# Altium schematic sheet [06] INERTIAL SENSOR.SchDoc: Template
size A4; Author: Hom; CompanyName: KitSprout; DrawnBy: Hom; Engineer: Hom; Organization: KitSprout; Revision: A; SheetNumber: 6; SheetTotal: 7; Version: 0.0; LibVersion: 0.0
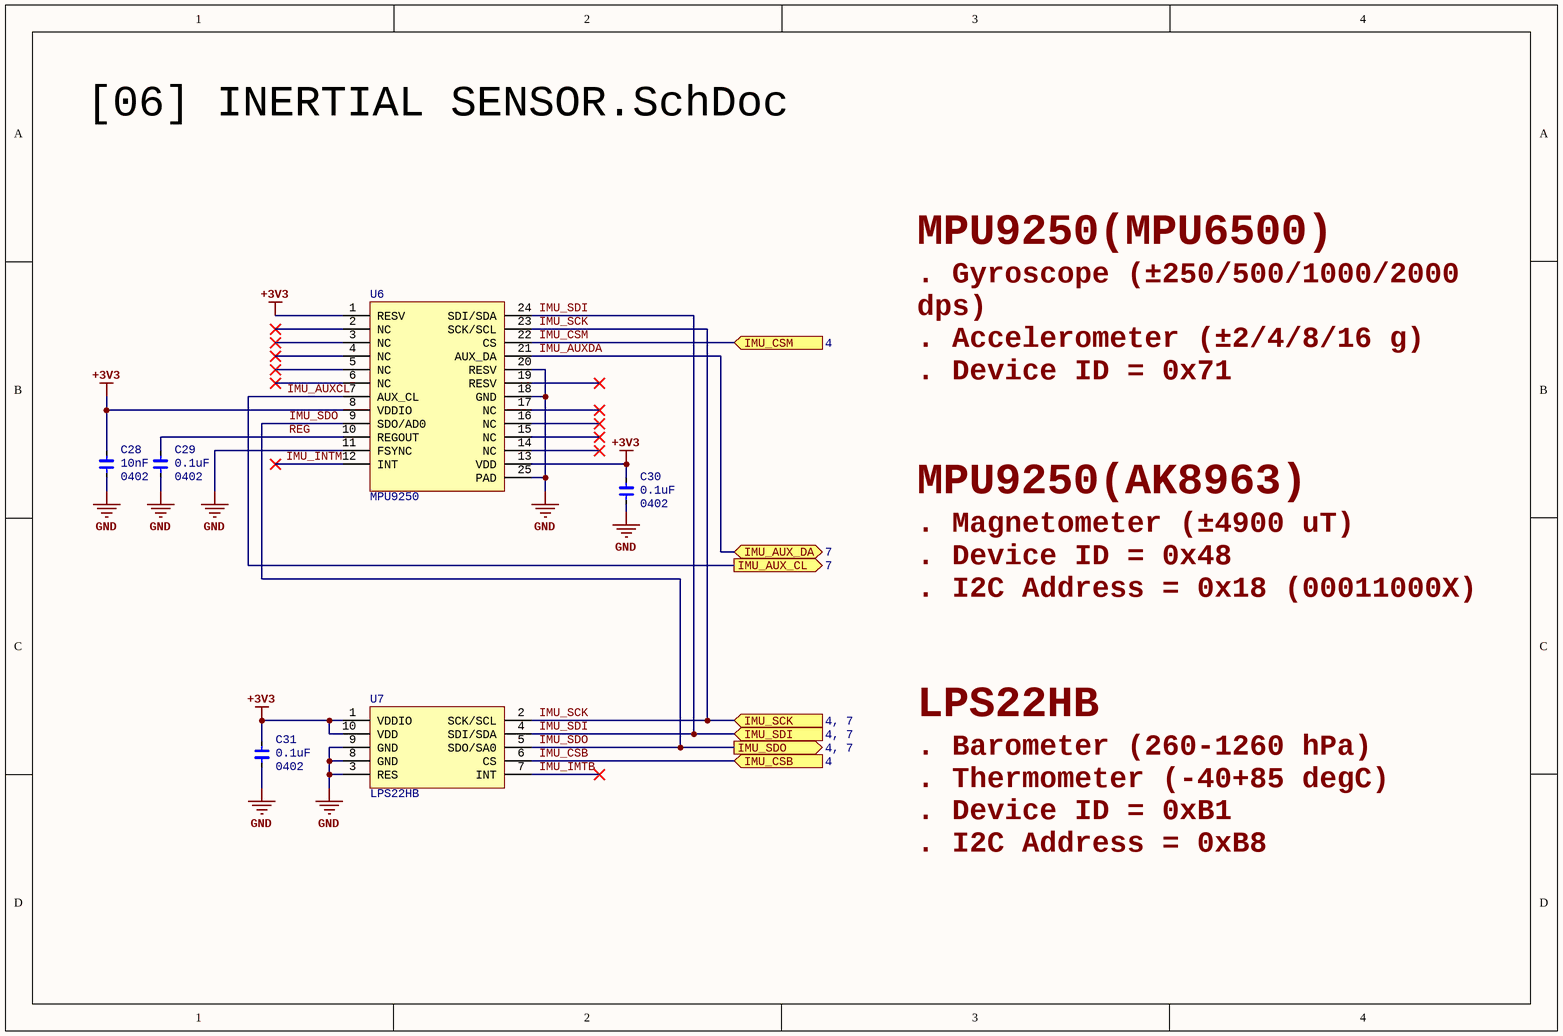
[diagram p0: [06] INERTIAL SENSOR.SchDoc]

## Parts
C28  value 10nF  Type: 0402  [CAP_0402]  (hidden comment: C0402)
C29  value 0.1uF  Type: 0402  [CAP_0402]  (hidden comment: C0402)
C30  value 0.1uF  Type: 0402  [CAP_0402]  (hidden comment: C0402)
C31  value 0.1uF  Type: 0402  [CAP_0402]  (hidden comment: C0402)
U6  MPU9250  [QFN_P0.4_24]
U7  LPS22HB  [HCLGA-2x2_10]

## Ports
IMU_AUX_CL (out, see 7), IMU_AUX_DA (bidir, see 7), IMU_CSB (in, see 4), IMU_CSM (in, see 4), IMU_SCK (in, see 4, 7), IMU_SDI (in, see 4, 7), IMU_SDO (out, see 4, 7)

## Nets
+3V3: C28.2 C30.2 C31.2 U6.1(RESV) U6.8(VDDIO) U6.13(VDD) U7.1(VDDIO) U7.10(VDD)
GND: C28.1 C29.1 C30.1 C31.1 U6.11(FSYNC) U6.18(GND) U6.20(RESV) U6.25(PAD) U7.3(RES) U7.8(GND) U7.9(GND)
IMU_AUXCL: U6.7(AUX_CL) ; port IMU_AUX_CL
IMU_AUXDA: U6.21(AUX_DA) ; port IMU_AUX_DA
IMU_CSB: U7.6(CS) ; port IMU_CSB
IMU_CSM: U6.22(CS) ; port IMU_CSM
IMU_IMTB: U7.7(INT)
IMU_INTM: U6.12(INT)
IMU_SCK: U6.23(SCK/SCL) U7.2(SCK/SCL) ; port IMU_SCK
IMU_SDI: U6.24(SDI/SDA) U7.4(SDI/SDA) ; port IMU_SDI
IMU_SDO: U6.9(SDO/AD0) U7.5(SDO/SA0) ; port IMU_SDO
REG: C29.2 U6.10(REGOUT)

Not connected (* = marked no-connect by the designer): U6 2(NC)* 3(NC)* 4(NC)* 5(NC)* 6(NC)* 14(NC)* 15(NC)* 16(NC)* 17(NC)* 19(RESV)*

## Notes on the sheet
- MPU9250(MPU6500)
- . Gyroscope (±250/500/1000/2000 dps)
  . Accelerometer (±2/4/8/16 g)
  . Device ID = 0x71
  . I2C Address = 0xD0 (1101000X)
- MPU9250(AK8963)
- . Magnetometer (±4900 uT)
  . Device ID = 0x48
  . I2C Address = 0x18 (00011000X)
- LPS22HB
- . Barometer (260-1260 hPa)
  . Thermometer (-40+85 degC)
  . Device ID = 0xB1
  . I2C Address = 0xB8

## Library data of the parts
C28-C31 = Cap_0402: Capacitor; Specification: X7R 50V; Manufacturer: *
U6 = MPU925x: Sensor Motion; Type: QFN24 P0.4
U7 = LPS22HB: Sensor Pressure; Type: LGA10 P0.5